# Altium schematic sheet 021_BUTTONs-LEDs.SchDoc
size 420 x 297 mm; Page Create Date: May 29, 2006; WebSite: https://www.seeedstudio.com; Page Number: 21; Drawing: qxn; Schematic Name: BeaglePlay; Page Size: A3; Comment: Seeed Title; Page Count: 22; Page Name: 021_BUTTONs & LEDs; Company: Seeed Studio; RevCode: v0.2; DsnPath: C:\Users\a0488739\Documents\GitHub\beagleplay\allegro\DVT\BEAGLEPLAYV020_220915.DSN; SchematicName: BeaglePlay; PageName: 021_BUTTONs & LEDs; PageSize: A3; TopSchematic: True
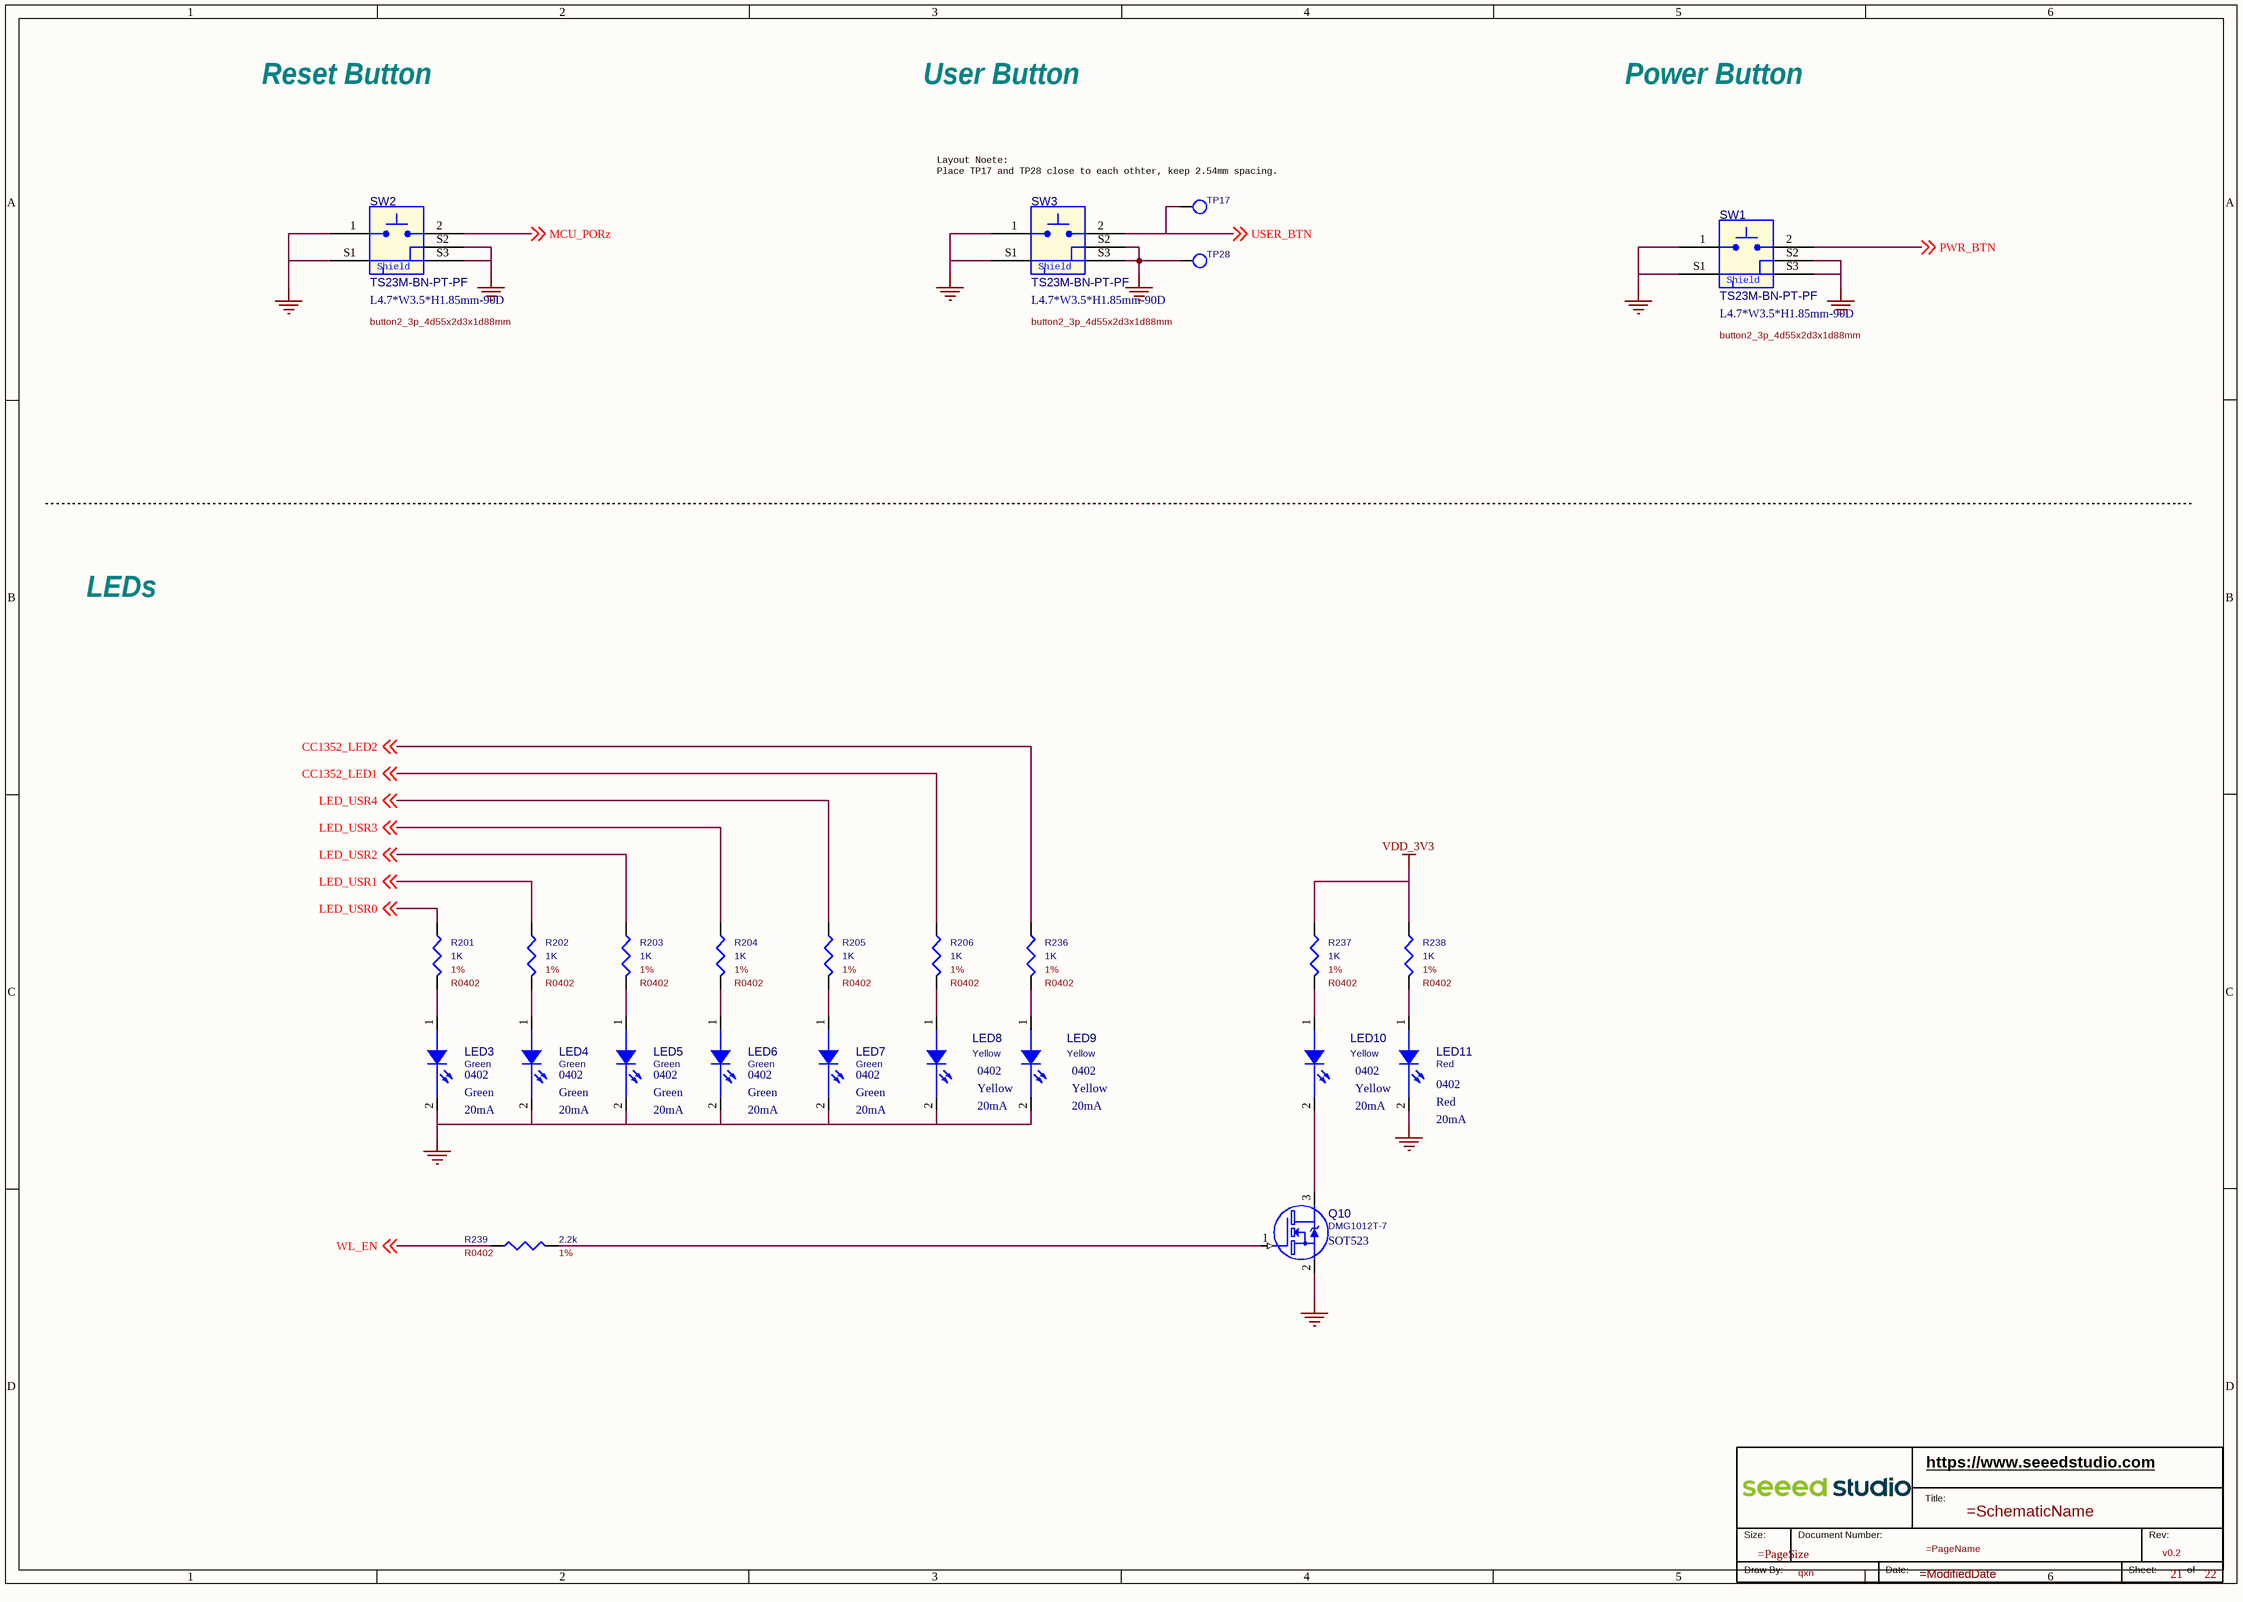
[diagram p0: 021_BUTTONs-LEDs.SchDoc]

## Parts
*  RevCode: v0.2  Page Number: 21  Page Count: 22  Drawing: qxn  (hidden comment: Seeed Title)  (graphical)
LED3  value Green  Package Size: 0402  Rated Current: 20mA  [led0402]  (hidden comment: Single LED)
LED4  value Green  Package Size: 0402  Rated Current: 20mA  [led0402]  (hidden comment: Single LED)
LED5  value Green  Package Size: 0402  Rated Current: 20mA  [led0402]  (hidden comment: Single LED)
LED6  value Green  Package Size: 0402  Rated Current: 20mA  [led0402]  (hidden comment: Single LED)
LED7  value Green  Package Size: 0402  Rated Current: 20mA  [led0402]  (hidden comment: Single LED)
LED8  value Yellow  Package Size: 0402  Rated Current: 20mA  [led0402]  (hidden comment: Single LED)
LED9  value Yellow  Package Size: 0402  Rated Current: 20mA  [led0402]  (hidden comment: Single LED)
LED10  value Yellow  Package Size: 0402  Rated Current: 20mA  [led0402]  (hidden comment: Single LED)
LED11  value Red  Package Size: 0402  Rated Current: 20mA  [led0402]  (hidden comment: Single LED)
Q10  value DMG1012T-7  Package Size: SOT523  [SOT_523]  (hidden comment: NMOS_123)
R201  value 1K  Rating: 1%  [R0402]  (hidden comment: R)
R202  value 1K  Rating: 1%  [R0402]  (hidden comment: R)
R203  value 1K  Rating: 1%  [R0402]  (hidden comment: R)
R204  value 1K  Rating: 1%  [R0402]  (hidden comment: R)
R205  value 1K  Rating: 1%  [R0402]  (hidden comment: R)
R206  value 1K  Rating: 1%  [R0402]  (hidden comment: R)
R236  value 1K  Rating: 1%  [R0402]  (hidden comment: R)
R237  value 1K  Rating: 1%  [R0402]  (hidden comment: R)
R238  value 1K  Rating: 1%  [R0402]  (hidden comment: R)
R239  value 2.2k  Rating: 1%  [R0402]  (hidden comment: R)
SW1  value TS23M-BN-PT-PF  Package Size: L4.7*W3.5*H1.85mm-90D  [button2_3p_4d55x2d3x1d88mm]  (hidden comment: Tactile Switch_2+3P)
SW2  value TS23M-BN-PT-PF  Package Size: L4.7*W3.5*H1.85mm-90D  [button2_3p_4d55x2d3x1d88mm]  (hidden comment: Tactile Switch_2+3P)
SW3  value TS23M-BN-PT-PF  Package Size: L4.7*W3.5*H1.85mm-90D  [button2_3p_4d55x2d3x1d88mm]  (hidden comment: Tactile Switch_2+3P)
TP17  Test Point  [tp1-8040]  (value not drawn)
TP28  Test Point  [tp1-8040]  (value not drawn)

## Nets
GND: LED3.2(C) LED4.2(C) LED5.2(C) LED6.2(C) LED7.2(C) LED8.2(C) LED9.2(C) LED11.2(C) Q10.2(S) SW1.1(A2) SW1.S1(A1) SW1.S2(B2) SW1.S3(B1) SW2.1(A2) SW2.S1(A1) SW2.S2(B2) SW2.S3(B1) SW3.1(A2) SW3.S1(A1) SW3.S2(B2) SW3.S3(B1) TP28.1(TP)
VDD_3V3: R237.1 R238.1
CC1352_LED1: R206.1 ; off-sheet CC1352_LED1
CC1352_LED2: R236.1 ; off-sheet CC1352_LED2
LED_USR0: R201.1 ; off-sheet LED_USR0
LED_USR1: R202.1 ; off-sheet LED_USR1
LED_USR2: R203.1 ; off-sheet LED_USR2
LED_USR3: R204.1 ; off-sheet LED_USR3
LED_USR4: R205.1 ; off-sheet LED_USR4
MCU_PORz: SW2.2(B3) ; off-sheet MCU_PORz
PWR_BTN: SW1.2(B3) ; off-sheet PWR_BTN
USER_BTN: SW3.2(B3) TP17.1(TP) ; off-sheet USER_BTN
WL_EN: R239.1 ; off-sheet WL_EN
NetLED3_1: LED3.1(A) R201.2
NetLED4_1: LED4.1(A) R202.2
NetLED5_1: LED5.1(A) R203.2
NetLED6_1: LED6.1(A) R204.2
NetLED7_1: LED7.1(A) R205.2
NetLED8_1: LED8.1(A) R206.2
NetLED9_1: LED9.1(A) R236.2
NetLED10_1: LED10.1(A) R237.2
NetLED10_2: LED10.2(C) Q10.3(D)
NetLED11_1: LED11.1(A) R238.2
NetQ10_1: Q10.1(G) R239.2

## Notes on the sheet
- Reset Button
- User Button
- Power Button
- (near TP17) Layout Noete:
  Place TP17 and TP28 close to each othter, keep 2.54mm spacing.
- LEDs
- (in symbol Seeed Title) https://www.seeedstudio.com; Title:; Size:; Document Number:; Rev:; Draw By:; Date:; Sheet:; of
- (in symbol Tactile Switch_2+3P) Shield

## Library data of the parts
* = Seeed Title: Company: Seeed Studio; WebSite: https://www.seeedstudio.com; Schematic Name: =SchematicName; Page Size: =PageSize; Page Name: =PageName; Page Create Date: May 29, 2006; Page Modify Date: =ModifiedDate
LED3 = Single LED: DIO, LED, Green, 20mA, --, --, 0402; Part Reference: LED3; Manufacturer: Bright; Manufacturer Part Number: 19-217/BHC-ZL1M2RY/3T; Company Part Status: CM4; Manufacturer PN: BL-HGE37A-AV-TRB; PN: 304090121; CLASS: DISCRETE; PCB Footprint: led0402; Part Type: LED; Status: BeagleBone Carrier Board; Temperature: -40¡ãC to 85¡ãC; LED Color: Green
LED4 = Single LED: DIO, LED, Green, 20mA, --, --, 0402; Part Reference: LED4; Manufacturer: Bright; Manufacturer Part Number: 19-217/BHC-ZL1M2RY/3T; Company Part Status: CM4; Manufacturer PN: BL-HGE37A-AV-TRB; PN: 304090121; CLASS: DISCRETE; PCB Footprint: led0402; Part Type: LED; Status: BeagleBone Carrier Board; Temperature: -40¡ãC to 85¡ãC; LED Color: Green
LED5 = Single LED: DIO, LED, Green, 20mA, --, --, 0402; Part Reference: LED5; Manufacturer: Bright; Manufacturer Part Number: 19-217/BHC-ZL1M2RY/3T; Company Part Status: CM4; Manufacturer PN: BL-HGE37A-AV-TRB; PN: 304090121; CLASS: DISCRETE; PCB Footprint: led0402; Part Type: LED; Status: BeagleBone Carrier Board; Temperature: -40¡ãC to 85¡ãC; LED Color: Green
LED6 = Single LED: DIO, LED, Green, 20mA, --, --, 0402; Part Reference: LED6; Manufacturer: Bright; Manufacturer Part Number: 19-217/BHC-ZL1M2RY/3T; Company Part Status: CM4; Manufacturer PN: BL-HGE37A-AV-TRB; PN: 304090121; CLASS: DISCRETE; PCB Footprint: led0402; Part Type: LED; Status: BeagleBone Carrier Board; Temperature: -40¡ãC to 85¡ãC; LED Color: Green
LED7 = Single LED: DIO, LED, Green, 20mA, --, --, 0402; Part Reference: LED7; Manufacturer: Bright; Manufacturer Part Number: 19-217/BHC-ZL1M2RY/3T; Company Part Status: CM4; Manufacturer PN: BL-HGE37A-AV-TRB; PN: 304090121; CLASS: DISCRETE; PCB Footprint: led0402; Status: BeagleBone Carrier Board; Part Type: LED; Temperature: -40¡ãC to 85¡ãC; LED Color: Green
LED8 = Single LED: DIO, LED, Yellow, 20mA, --, --, 0402; Part Reference: LED8; Company Part Status: CM4; Manufacturer: Everlight; Manufacturer PN: 16-213/Y2C-AN2Q1B/3T; PN: 304090746; CLASS: DISCRETE; PCB Footprint: led0402; LED Color: Yellow
LED9 = Single LED: DIO, LED, Yellow, 20mA, --, --, 0402; Part Reference: LED9; Company Part Status: CM4; Manufacturer: Everlight; Manufacturer PN: 16-213/Y2C-AN2Q1B/3T; PN: 304090746; CLASS: DISCRETE; PCB Footprint: led0402; LED Color: Yellow
LED10 = Single LED: DIO, LED, Yellow, 20mA, --, --, 0402; Part Reference: LED10; Company Part Status: CM4; Manufacturer: Everlight; Manufacturer PN: 16-213/Y2C-AN2Q1B/3T; PN: 304090746; CLASS: DISCRETE; PCB Footprint: led0402; LED Color: Yellow
LED11 = Single LED: DIO, LED, Red, 20mA, , , 0402; Part Reference: LED11; Manufacturer: Bright; Manufacturer Part Number: 19-217/BHC-ZL1M2RY/3T; Company Part Status: ST; Manufacturer PN: BL-HUB37A-AV-TRB; PN: 304090122; CLASS: DISCRETE; PCB Footprint: led0402; Part Type: LED; Status: BeagleBone Carrier Board; Temperature: -40¡ãC to 85¡ãC; LED Color: Red
Q10 = NMOS_123: XSTR, MOSFET, N-Channel, DMG1012T-7, 20V, 630mA, SOT523, SMD; Part Reference: Q10; Manufacturer: Diodes; Company Part Status: BeagleX; CLASS: DISCRETE; PN: 305030659; PCB Footprint: SOT_523; Manufacturer PN: DMG1012T-7; Polarity: N-Channel
R201 = R: RES, Thick Film, 1K, 1%, 1/16W, SMD, 0402; Part Reference: R201; Manufacturer PN: RC0402FR-071KL; Company Part Status: Combox Pro; Manufacturer Part Number: RC0402JR-071KL; Manufacturer: YAGEO; CLASS: DISCRETE; PN: 301010044; PCB Footprint: R0402; Rated Power: 1/16W; Package Size: 0402; Temperature: -55¡ãC to 155¡ãC; Part Type: RES; Status: BeagleBone Carrier Board
R202 = R: RES, Thick Film, 1K, 1%, 1/16W, SMD, 0402; Part Reference: R202; Manufacturer PN: RC0402FR-071KL; Company Part Status: Combox Pro; Manufacturer Part Number: RC0402JR-071KL; Manufacturer: YAGEO; CLASS: DISCRETE; PN: 301010044; PCB Footprint: R0402; Rated Power: 1/16W; Package Size: 0402; Temperature: -55¡ãC to 155¡ãC; Status: BeagleBone Carrier Board; Part Type: RES
R203 = R: RES, Thick Film, 1K, 1%, 1/16W, SMD, 0402; Part Reference: R203; Manufacturer PN: RC0402FR-071KL; Company Part Status: Combox Pro; Manufacturer Part Number: RC0402JR-071KL; Manufacturer: YAGEO; CLASS: DISCRETE; PN: 301010044; PCB Footprint: R0402; Rated Power: 1/16W; Package Size: 0402; Temperature: -55¡ãC to 155¡ãC; Part Type: RES; Status: BeagleBone Carrier Board
R204 = R: RES, Thick Film, 1K, 1%, 1/16W, SMD, 0402; Part Reference: R204; Manufacturer PN: RC0402FR-071KL; Company Part Status: Combox Pro; Manufacturer Part Number: RC0402JR-071KL; Manufacturer: YAGEO; CLASS: DISCRETE; PN: 301010044; PCB Footprint: R0402; Rated Power: 1/16W; Package Size: 0402; Temperature: -55¡ãC to 155¡ãC; Status: BeagleBone Carrier Board; Part Type: RES
R205 = R: RES, Thick Film, 1K, 1%, 1/16W, SMD, 0402; Part Reference: R205; Manufacturer PN: RC0402FR-071KL; Company Part Status: Combox Pro; Manufacturer Part Number: RC0402JR-071KL; Manufacturer: YAGEO; CLASS: DISCRETE; PN: 301010044; PCB Footprint: R0402; Rated Power: 1/16W; Package Size: 0402; Temperature: -55¡ãC to 155¡ãC; Status: BeagleBone Carrier Board; Part Type: RES
R206 = R: RES, Thick Film, 1K, 1%, 1/16W, SMD, 0402; Part Reference: R206; Manufacturer PN: RC0402FR-071KL; Company Part Status: Combox Pro; Manufacturer Part Number: RC0402JR-071KL; Manufacturer: YAGEO; CLASS: DISCRETE; PN: 301010044; PCB Footprint: R0402; Rated Power: 1/16W; Package Size: 0402; Temperature: -55¡ãC to 155¡ãC; Status: BeagleBone Carrier Board; Part Type: RES
R236 = R: RES, Thick Film, 1K, 1%, 1/16W, SMD, 0402; Part Reference: R236; Manufacturer PN: RC0402FR-071KL; Company Part Status: Combox Pro; Manufacturer Part Number: RC0402JR-071KL; Manufacturer: YAGEO; CLASS: DISCRETE; PN: 301010044; PCB Footprint: R0402; Rated Power: 1/16W; Package Size: 0402; Temperature: -55¡ãC to 155¡ãC; Status: BeagleBone Carrier Board; Part Type: RES
R237 = R: RES, Thick Film, 1K, 1%, 1/16W, SMD, 0402; Part Reference: R237; Manufacturer PN: RC0402FR-071KL; Company Part Status: Combox Pro; Manufacturer: YAGEO; Manufacturer Part Number: RC0402JR-071KL; CLASS: DISCRETE; PN: 301010044; PCB Footprint: R0402; Rated Power: 1/16W; Package Size: 0402; Part Type: RES; Status: BeagleBone Carrier Board; Temperature: -55¡ãC to 155¡ãC
R238 = R: RES, Thick Film, 1K, 1%, 1/16W, SMD, 0402; Part Reference: R238; Manufacturer Part Number: RC0402JR-071KL; Manufacturer: YAGEO; Company Part Status: Combox Pro; Manufacturer PN: RC0402FR-071KL; PN: 301010044; CLASS: DISCRETE; PCB Footprint: R0402; Temperature: -55¡ãC to 155¡ãC; Status: BeagleBone Carrier Board; Part Type: RES; Package Size: 0402; Rated Power: 1/16W
R239 = R: RES, Thick Film, 2.2k, 1%, 1/16W, SMD, 0402; Part Reference: R239; Company Part Status: ST; Manufacturer: YAGEO; Manufacturer PN: RC0402FR-072K2L; SIGNAL_MODEL: DEFAULT_RESISTOR_2200OHM_1_2; PN: 301010746; CLASS: DISCRETE; PCB Footprint: R0402; Package Size: 0402; Rated Power: 1/16W
SW1 = Tactile Switch_2+3P: SW, Tactile Switch, TS23M-BN-PT-PF, --, 5, SMD; Part Reference: SW1; Manufacturer: ROKI; Company Part Status: CM4; CLASS: DISCRETE; PN: 311021319; PCB Footprint: button2_3p_4d55x2d3x1d88mm; Manufacturer PN: TS23M-BN-PT-PF
SW2 = Tactile Switch_2+3P: SW, Tactile Switch, TS23M-BN-PT-PF, --, 5, SMD; Part Reference: SW2; Company Part Status: CM4; Manufacturer: ROKI; PN: 311021319; CLASS: DISCRETE; PCB Footprint: button2_3p_4d55x2d3x1d88mm; Manufacturer PN: TS23M-BN-PT-PF
SW3 = Tactile Switch_2+3P: SW, Tactile Switch, TS23M-BN-PT-PF, --, 5, SMD; Part Reference: SW3; Company Part Status: CM4; Manufacturer: ROKI; PN: 311021319; CLASS: DISCRETE; PCB Footprint: button2_3p_4d55x2d3x1d88mm; Manufacturer PN: TS23M-BN-PT-PF
TP17 = Test Point: MISC, Test Point, Test Point, SMD, TP35S_SMD; Part Reference: TP17; Company Part Status: Mini-Gateway; ASSY: DNP; CLASS: DISCRETE; PCB Footprint: TP35S_SMD; Value: Test Point; PN: TP35S_SMD; Package Size: TP35S_SMD
TP28 = Test Point: MISC, Test Point, Test Point, SMD, TP35S_SMD; Part Reference: TP28; Company Part Status: Mini-Gateway; ASSY: DNP; CLASS: DISCRETE; PCB Footprint: TP35S_SMD; Value: Test Point; PN: TP35S_SMD; Package Size: TP35S_SMD